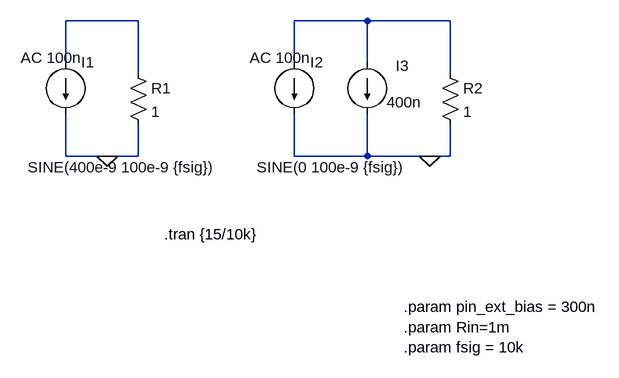
[diagram p0: schematic Draft1.asc]
Draft1.asc, the LTspice schematic file:
Version 4
SHEET 1 880 680
WIRE -1312 -624 -1424 -624
WIRE -960 -624 -1072 -624
WIRE -832 -624 -960 -624
WIRE -1424 -560 -1424 -624
WIRE -1072 -560 -1072 -624
WIRE -960 -560 -960 -624
WIRE -1312 -544 -1312 -624
WIRE -832 -544 -832 -624
WIRE -1424 -416 -1424 -480
WIRE -1360 -416 -1424 -416
WIRE -1312 -416 -1312 -464
WIRE -1312 -416 -1360 -416
WIRE -1072 -416 -1072 -480
WIRE -960 -416 -960 -480
WIRE -960 -416 -1072 -416
WIRE -864 -416 -960 -416
WIRE -832 -416 -832 -464
WIRE -832 -416 -864 -416
FLAG -1360 -416 0
FLAG -864 -416 0
SYMBOL current -1424 -560 R0
WINDOW 3 -58 161 Left 2
WINDOW 123 -69 -7 Left 2
WINDOW 39 0 0 Left 2
SYMATTR Value SINE(400e-9 100e-9 {fsig})
SYMATTR Value2 AC 100n
SYMATTR InstName I1
SYMBOL current -1072 -560 R0
WINDOW 3 -58 161 Left 2
WINDOW 123 -69 -7 Left 2
WINDOW 39 0 0 Left 2
SYMATTR Value SINE(0 100e-9 {fsig})
SYMATTR Value2 AC 100n
SYMATTR InstName I2
SYMBOL current -960 -560 R0
WINDOW 3 30 61 Left 2
WINDOW 123 41 35 Left 2
WINDOW 39 0 0 Left 2
WINDOW 0 44 5 Left 2
SYMATTR Value 400n
SYMATTR InstName I3
SYMBOL res -1328 -560 R0
SYMATTR InstName R1
SYMATTR Value 1
SYMBOL res -848 -560 R0
SYMATTR InstName R2
SYMATTR Value 1
TEXT -1272 -296 Left 2 !.tran {15/10k}
TEXT -904 -184 Left 2 !.param pin_ext_bias = 300n\n.param Rin=1m\n.param fsig = 10k

The netlist it stands for:
* Draft1.asc
I1 N001 0 SINE(400e-9 100e-9 {fsig}) AC 100n
I2 N002 0 SINE(0 100e-9 {fsig}) AC 100n
I3 N002 0 400n
R1 N001 0 1
R2 N002 0 1
.tran {15/10k}
.param pin_ext_bias = 300n
.param Rin=1m
.param fsig = 10k
.backanno
.end